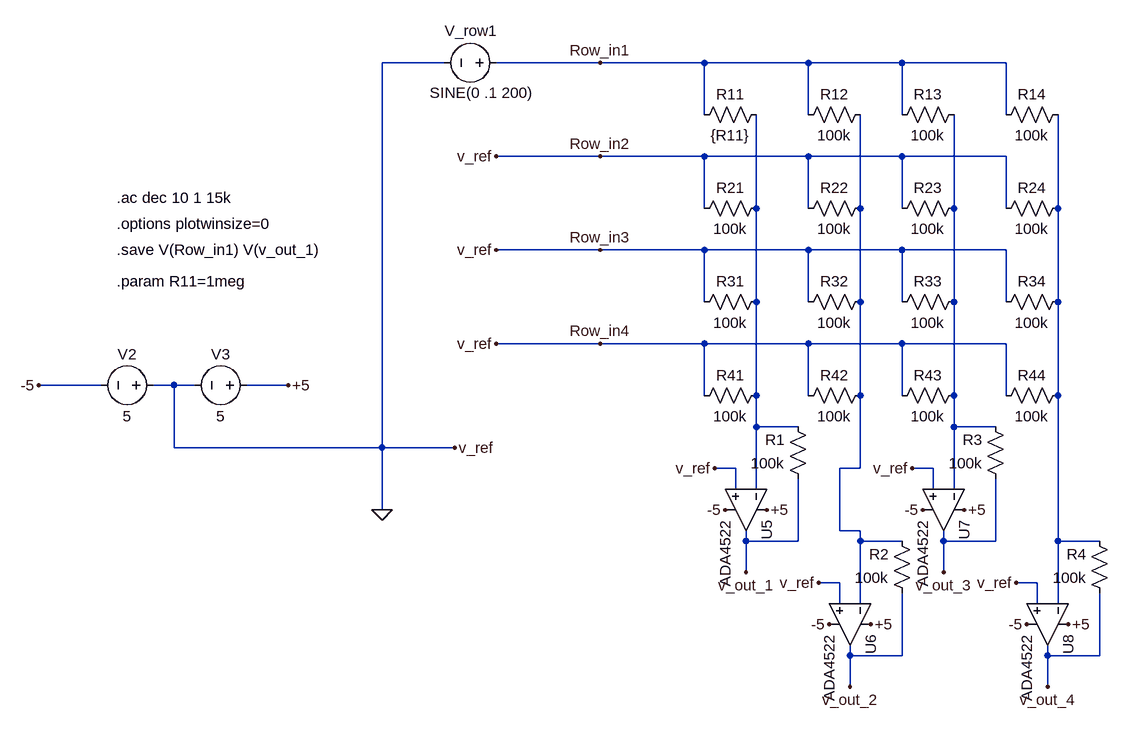
[diagram p0: schematic 01_AC_Analysis.asc]
01_AC_Analysis.asc, the LTspice schematic file:
Version 4
SHEET 1 880 1008
WIRE -3680 -256 -3776 -256
WIRE -3440 -256 -3600 -256
WIRE -3280 -256 -3440 -256
WIRE -3120 -256 -3280 -256
WIRE -2976 -256 -3120 -256
WIRE -2816 -256 -2976 -256
WIRE -3280 -176 -3280 -256
WIRE -3120 -176 -3120 -256
WIRE -2976 -176 -2976 -256
WIRE -2816 -176 -2816 -256
WIRE -3440 -112 -3600 -112
WIRE -3280 -112 -3440 -112
WIRE -3120 -112 -3280 -112
WIRE -2976 -112 -3120 -112
WIRE -2816 -112 -2976 -112
WIRE -3280 -32 -3280 -112
WIRE -3200 -32 -3200 -176
WIRE -3120 -32 -3120 -112
WIRE -3040 -32 -3040 -176
WIRE -2976 -32 -2976 -112
WIRE -2896 -32 -2896 -176
WIRE -2816 -32 -2816 -112
WIRE -2736 -32 -2736 -176
WIRE -3440 32 -3600 32
WIRE -3280 32 -3440 32
WIRE -3120 32 -3280 32
WIRE -2976 32 -3120 32
WIRE -2816 32 -2976 32
WIRE -3280 112 -3280 32
WIRE -3200 112 -3200 -32
WIRE -3120 112 -3120 32
WIRE -3040 112 -3040 -32
WIRE -2976 112 -2976 32
WIRE -2896 112 -2896 -32
WIRE -2816 112 -2816 32
WIRE -2736 112 -2736 -32
WIRE -3440 176 -3600 176
WIRE -3280 176 -3440 176
WIRE -3120 176 -3280 176
WIRE -2976 176 -3120 176
WIRE -2816 176 -2976 176
WIRE -4208 240 -4304 240
WIRE -4096 240 -4128 240
WIRE -4064 240 -4096 240
WIRE -3920 240 -3984 240
WIRE -3280 256 -3280 176
WIRE -3200 256 -3200 112
WIRE -3120 256 -3120 176
WIRE -3040 256 -3040 112
WIRE -2976 256 -2976 176
WIRE -2896 256 -2896 112
WIRE -2816 256 -2816 176
WIRE -2736 256 -2736 112
WIRE -3200 304 -3200 256
WIRE -3136 304 -3200 304
WIRE -2896 304 -2896 256
WIRE -2832 304 -2896 304
WIRE -4096 336 -4096 240
WIRE -3776 336 -3776 -256
WIRE -3776 336 -4096 336
WIRE -3664 336 -3776 336
WIRE -3232 368 -3264 368
WIRE -3040 368 -3040 256
WIRE -3040 368 -3072 368
WIRE -2928 368 -2960 368
WIRE -3232 400 -3232 368
WIRE -3200 400 -3200 304
WIRE -2928 400 -2928 368
WIRE -2896 400 -2896 304
WIRE -3776 432 -3776 336
WIRE -3072 464 -3072 368
WIRE -3040 464 -3072 464
WIRE -3216 480 -3216 464
WIRE -3136 480 -3136 384
WIRE -3136 480 -3216 480
WIRE -3040 480 -3040 464
WIRE -2976 480 -3040 480
WIRE -2912 480 -2912 464
WIRE -2832 480 -2832 384
WIRE -2832 480 -2912 480
WIRE -2736 480 -2736 256
WIRE -2672 480 -2736 480
WIRE -3216 528 -3216 480
WIRE -2912 528 -2912 480
WIRE -3072 544 -3104 544
WIRE -2768 544 -2800 544
WIRE -3072 576 -3072 544
WIRE -3040 576 -3040 480
WIRE -2768 576 -2768 544
WIRE -2736 576 -2736 480
WIRE -3056 656 -3056 640
WIRE -2976 656 -2976 560
WIRE -2976 656 -3056 656
WIRE -2752 656 -2752 640
WIRE -2672 656 -2672 560
WIRE -2672 656 -2752 656
WIRE -3056 704 -3056 656
WIRE -2752 704 -2752 656
FLAG -3776 432 0
FLAG -3920 240 +5
FLAG -4304 240 -5
FLAG -3184 432 +5
FLAG -3248 432 -5
FLAG -3264 368 v_ref
FLAG -3664 336 v_ref
FLAG -3024 608 +5
FLAG -3088 608 -5
FLAG -3104 544 v_ref
FLAG -2880 432 +5
FLAG -2944 432 -5
FLAG -2960 368 v_ref
FLAG -2720 608 +5
FLAG -2784 608 -5
FLAG -2800 544 v_ref
FLAG -3216 528 v_out_1
FLAG -3056 704 v_out_2
FLAG -2912 528 v_out_3
FLAG -2752 704 v_out_4
FLAG -3440 -256 Row_in1
FLAG -3440 -112 Row_in2
FLAG -3440 32 Row_in3
FLAG -3440 176 Row_in4
FLAG -3600 176 v_ref
FLAG -3600 32 v_ref
FLAG -3600 -112 v_ref
SYMBOL voltage -4112 240 R90
WINDOW 0 -32 56 VBottom 2
WINDOW 3 32 56 VTop 2
WINDOW 123 0 0 Left 0
WINDOW 39 0 0 Left 0
SYMATTR InstName V2
SYMATTR Value 5
SYMBOL voltage -3968 240 R90
WINDOW 0 -32 56 VBottom 2
WINDOW 3 32 56 VTop 2
WINDOW 123 0 0 Left 0
WINDOW 39 0 0 Left 0
SYMATTR InstName V3
SYMATTR Value 5
SYMBOL res -3184 -192 R90
WINDOW 0 0 56 VBottom 2
WINDOW 3 32 56 VTop 2
SYMATTR InstName R11
SYMATTR Value {R11}
SYMBOL res -3024 -192 R90
WINDOW 0 0 56 VBottom 2
WINDOW 3 32 56 VTop 2
SYMATTR InstName R12
SYMATTR Value 100k
SYMBOL res -2880 -192 R90
WINDOW 0 0 56 VBottom 2
WINDOW 3 32 56 VTop 2
SYMATTR InstName R13
SYMATTR Value 100k
SYMBOL res -2720 -192 R90
WINDOW 0 0 56 VBottom 2
WINDOW 3 32 56 VTop 2
SYMATTR InstName R14
SYMATTR Value 100k
SYMBOL res -3184 -48 R90
WINDOW 0 0 56 VBottom 2
WINDOW 3 32 56 VTop 2
SYMATTR InstName R21
SYMATTR Value 100k
SYMBOL res -3024 -48 R90
WINDOW 0 0 56 VBottom 2
WINDOW 3 32 56 VTop 2
SYMATTR InstName R22
SYMATTR Value 100k
SYMBOL res -2880 -48 R90
WINDOW 0 0 56 VBottom 2
WINDOW 3 32 56 VTop 2
SYMATTR InstName R23
SYMATTR Value 100k
SYMBOL res -2720 -48 R90
WINDOW 0 0 56 VBottom 2
WINDOW 3 32 56 VTop 2
SYMATTR InstName R24
SYMATTR Value 100k
SYMBOL res -3184 96 R90
WINDOW 0 0 56 VBottom 2
WINDOW 3 32 56 VTop 2
SYMATTR InstName R31
SYMATTR Value 100k
SYMBOL res -3024 96 R90
WINDOW 0 0 56 VBottom 2
WINDOW 3 32 56 VTop 2
SYMATTR InstName R32
SYMATTR Value 100k
SYMBOL res -2880 96 R90
WINDOW 0 0 56 VBottom 2
WINDOW 3 32 56 VTop 2
SYMATTR InstName R33
SYMATTR Value 100k
SYMBOL res -2720 96 R90
WINDOW 0 0 56 VBottom 2
WINDOW 3 32 56 VTop 2
SYMATTR InstName R34
SYMATTR Value 100k
SYMBOL res -3184 240 R90
WINDOW 0 0 56 VBottom 2
WINDOW 3 32 56 VTop 2
SYMATTR InstName R41
SYMATTR Value 100k
SYMBOL res -3024 240 R90
WINDOW 0 0 56 VBottom 2
WINDOW 3 32 56 VTop 2
SYMATTR InstName R42
SYMATTR Value 100k
SYMBOL res -2880 240 R90
WINDOW 0 0 56 VBottom 2
WINDOW 3 32 56 VTop 2
SYMATTR InstName R43
SYMATTR Value 100k
SYMBOL res -2720 240 R90
WINDOW 0 0 56 VBottom 2
WINDOW 3 32 56 VTop 2
SYMATTR InstName R44
SYMATTR Value 100k
SYMBOL voltage -3584 -256 R90
WINDOW 3 46 -41 VRight 2
WINDOW 0 -49 14 VRight 2
WINDOW 39 0 0 Left 0
SYMATTR Value SINE(0 .1 200)
SYMATTR InstName V_row1
SYMATTR Value2 AC .1
SYMBOL res -3120 400 R180
WINDOW 0 36 76 Left 2
WINDOW 3 36 40 Left 2
SYMATTR InstName R1
SYMATTR Value 100k
SYMBOL res -2960 576 R180
WINDOW 0 36 76 Left 2
WINDOW 3 36 40 Left 2
SYMATTR InstName R2
SYMATTR Value 100k
SYMBOL res -2816 400 R180
WINDOW 0 36 76 Left 2
WINDOW 3 36 40 Left 2
SYMATTR InstName R3
SYMATTR Value 100k
SYMBOL res -2656 576 R180
WINDOW 0 36 76 Left 2
WINDOW 3 36 40 Left 2
SYMATTR InstName R4
SYMATTR Value 100k
SYMBOL OpAmps\\ADA4522 -3152 432 R90
SYMATTR InstName U5
SYMBOL OpAmps\\ADA4522 -2992 608 R90
SYMATTR InstName U6
SYMBOL OpAmps\\ADA4522 -2848 432 R90
SYMATTR InstName U7
SYMBOL OpAmps\\ADA4522 -2688 608 R90
SYMATTR InstName U8
TEXT -4184 32 Left 2 !.save V(Row_in1) V(v_out_1)
TEXT -4184 -8 Left 2 !.options plotwinsize=0
TEXT -4184 80 Left 2 !.param R11=1meg
TEXT -4184 -48 Left 2 !.ac dec 10 1 15k

The netlist it stands for:
* 01_AC_Analysis.asc
V2 0 -5 5
V3 +5 0 5
R11 N001 Row_in1 {R11}
R12 N002 Row_in1 100k
R13 N003 Row_in1 100k
R14 N004 Row_in1 100k
R21 N001 0 100k
R22 N002 0 100k
R23 N003 0 100k
R24 N004 0 100k
R31 N001 0 100k
R32 N002 0 100k
R33 N003 0 100k
R34 N004 0 100k
R41 N001 0 100k
R42 N002 0 100k
R43 N003 0 100k
R44 N004 0 100k
V_row1 Row_in1 0 SINE(0 .1 200) AC .1
R1 v_out_1 N001 100k
R2 v_out_2 N002 100k
R3 v_out_3 N003 100k
R4 v_out_4 N004 100k
XU5 0 N001 +5 -5 v_out_1 ADA4522  ; pins In+ In- V+ V- OUT
XU6 0 N002 +5 -5 v_out_2 ADA4522  ; pins In+ In- V+ V- OUT
XU7 0 N003 +5 -5 v_out_3 ADA4522  ; pins In+ In- V+ V- OUT
XU8 0 N004 +5 -5 v_out_4 ADA4522  ; pins In+ In- V+ V- OUT
.save V(Row_in1) V(v_out_1)
.options plotwinsize=0
.param R11=1meg
.ac dec 10 1 15k
.backanno
.end